# Altium project MOTOR_DRV_Projx.PrjPcb
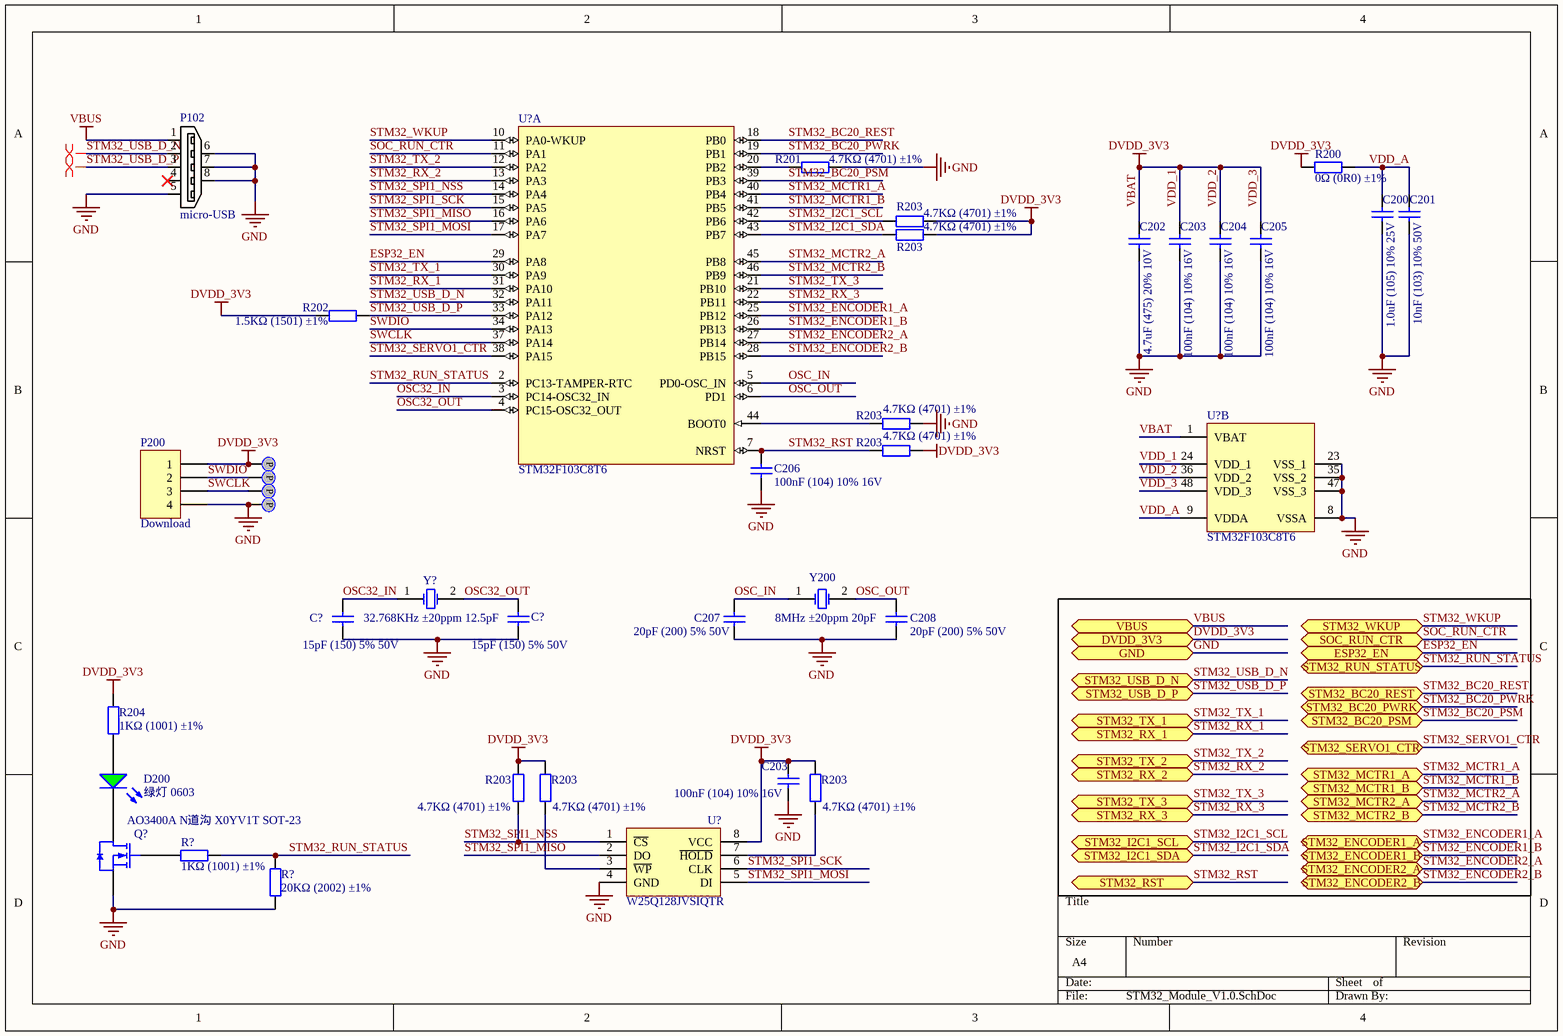
[diagram p0: STM32_Module_V1.0.SchDoc]
6 sheets, 151 parts. Net scope: flat (ports and power ports of the same name join across sheets).
Sheets:
  STM32_Module_V1.0.SchDoc
  ESP32_Module_V1.0.SchDoc
  BC20_Module_V1.0.SchDoc
  Motor_Driver_V1.0.SchDoc
  I2C_SENSOR_V1.0.SchDoc
  PWR_SWITCH_CON_V1.0.SchDoc

## Sheet STM32_Module_V1.0.SchDoc
size A4

### Parts
(Parts that share a designator on the sheet are numbered #1, #2 ... from top to bottom, then left to right.)
C200#1  1.0uF (105) 10% 25V  [0402_C]
C201#1  10nF (103) 10% 50V  [0402_C]
C202#1  4.7uF (475) 20% 10V  [0402_C]
C203#1  100nF (104) 10% 16V  [0402_C]
C203#2  100nF (104) 10% 16V  [0402_C]
C204  100nF (104) 10% 16V  [0402_C]
C205  100nF (104) 10% 16V  [0402_C]
C206  100nF (104) 10% 16V  [0402_C]
C207  20pF (200) 5% 50V  [0402_C]
C208  20pF (200) 5% 50V  [0402_C]
C?#1  15pF (150) 5% 50V  [0402_C]
C?#2  15pF (150) 5% 50V  [0402_C]
D200  绿灯 0603  [0603_LED_S1]
P102#1  micro-USB  [USB_MICRO]
P200  Download  [HDR1X4]
Probe100  Test Point  [Probe]  (value not drawn)
Probe101  Test Point  [Probe]  (value not drawn)
Probe103  Test Point  [Probe]  (value not drawn)
Probe104  Test Point  [Probe]  (value not drawn)
Q?#1  AO3400A N道沟 X0YV1T SOT-23  [SOT-23-3L]
R200  0Ω (0R0) ±1%  [0402_R]
R201  4.7KΩ (4701) ±1%  [0402_R]
R202  1.5KΩ (1501) ±1%  [0402_R]
R203#1  4.7KΩ (4701) ±1%  [0402_R]
R203#2  4.7KΩ (4701) ±1%  [0402_R]
R203#3  4.7KΩ (4701) ±1%  [0402_R]
R203#4  4.7KΩ (4701) ±1%  [0402_R]
R203#5  4.7KΩ (4701) ±1%  [0402_R]
R203#6  4.7KΩ (4701) ±1%  [0402_R]
R203#7  4.7KΩ (4701) ±1%  [0402_R]
R204  1KΩ (1001) ±1%  [0603_R]
R?#1  1KΩ (1001) ±1%  [0402_R]
R?#2  20KΩ (2002) ±1%  [0402_R]
U?#1  STM32F103C8T6  [LQFP-48_7x7x05P]  (part A of 2)
U?#2  STM32F103C8T6  [LQFP-48_7x7x05P]  (part B of 2)
U?#3  W25Q128JVSIQTR  [SOIC-8_208mil]
Y200  8MHz ±20ppm 20pF  [SMD-5032_2P]
Y?#1  32.768KHz ±20ppm 12.5pF  [SMD-3215_2P FC - 135]

### Ports
DVDD_3V3, ESP32_EN, GND, SOC_RUN_CTR, STM32_BC20_PSM, STM32_BC20_PWRK, STM32_BC20_REST, STM32_ENCODER1_A, STM32_ENCODER1_B, STM32_ENCODER2_A, STM32_ENCODER2_B, STM32_I2C1_SCL, STM32_I2C1_SDA, STM32_MCTR1_A, STM32_MCTR1_B, STM32_MCTR2_A, STM32_MCTR2_B, STM32_RST, STM32_RUN_STATUS, STM32_RX_1, STM32_RX_2, STM32_RX_3, STM32_SERVO1_CTR, STM32_TX_1, STM32_TX_2, STM32_TX_3, STM32_USB_D_N, STM32_USB_D_P, STM32_WKUP, VBUS

### Nets
DVDD_3V3: C202#1.2 C203#1.2 C203#2.2 C204.2 C205.2 P200.1 Probe100.0 R200.1 R202.2 R203#1.2 R203#2.2 R203#4.2 R203#5.2 R203#6.2 R203#7.2 R204.2 U?#2.1(VBAT) U?#2.24(VDD_1) U?#2.36(VDD_2) U?#2.48(VDD_3) U?#3.8(VCC) ; port DVDD_3V3  [also labelled VBAT, VDD_1, VDD_2, VDD_3]
GND: C200#1.1 C201#1.1 C202#1.1 C203#1.1 C203#2.1 C204.1 C205.1 C206.2 C207.1 C208.1 C?#1.1 C?#2.1 P102#1.5(GND) P102#1.6(SHELL) P102#1.7(SHELL) P102#1.8(SHELL) P200.4 Probe104.0 Q?#1.2(S) R201.2 R203#3.2 R?#2.1 U?#2.8(VSSA) U?#2.23(VSS_1) U?#2.35(VSS_2) U?#2.47(VSS_3) U?#3.4(GND) ; port GND
VBUS: P102#1.1(VBUS) ; port VBUS
ESP32_EN: U?#1.29(PA8) ; port ESP32_EN  [project net EN]
OSC32_IN: C?#1.2 U?#1.3(PC14-OSC32_IN) Y?#1.1(OSC1)
OSC32_OUT: C?#2.2 U?#1.4(PC15-OSC32_OUT) Y?#1.2(OSC2)
OSC_IN: C207.2 U?#1.5(PD0-OSC_IN) Y200.1(OSC1)
OSC_OUT: C208.2 U?#1.6(PD1) Y200.2(OSC2)
SOC_RUN_CTR: U?#1.11(PA1) ; port SOC_RUN_CTR
STM32_BC20_PSM: U?#1.39(PB3) ; port STM32_BC20_PSM
STM32_BC20_PWRK: U?#1.19(PB1) ; port STM32_BC20_PWRK
STM32_BC20_REST: U?#1.18(PB0) ; port STM32_BC20_REST
STM32_ENCODER1_A: U?#1.25(PB12) ; port STM32_ENCODER1_A
STM32_ENCODER1_B: U?#1.26(PB13) ; port STM32_ENCODER1_B
STM32_ENCODER2_A: U?#1.27(PB14) ; port STM32_ENCODER2_A
STM32_ENCODER2_B: U?#1.28(PB15) ; port STM32_ENCODER2_B
STM32_I2C1_SCL: R203#1.1 U?#1.42(PB6) ; port STM32_I2C1_SCL
STM32_I2C1_SDA: R203#2.1 U?#1.43(PB7) ; port STM32_I2C1_SDA
STM32_MCTR1_A: U?#1.40(PB4) ; port STM32_MCTR1_A
STM32_MCTR1_B: U?#1.41(PB5) ; port STM32_MCTR1_B
STM32_MCTR2_A: U?#1.45(PB8) ; port STM32_MCTR2_A
STM32_MCTR2_B: U?#1.46(PB9) ; port STM32_MCTR2_B
STM32_RST: C206.1 R203#4.1 U?#1.7(NRST) ; port STM32_RST  [project net IO21]
STM32_RUN_STATUS: R?#1.2 R?#2.2 U?#1.2(PC13-TAMPER-RTC) ; port STM32_RUN_STATUS  [project net CH_SELECT]
STM32_RX_1: U?#1.31(PA10) ; port STM32_RX_1
STM32_RX_2: U?#1.13(PA3) ; port STM32_RX_2
STM32_RX_3: U?#1.22(PB11) ; port STM32_RX_3  [project net ESP32_TX1]
STM32_SERVO1_CTR: U?#1.38(PA15) ; port STM32_SERVO1_CTR
STM32_SPI1_MISO: U?#1.16(PA6) U?#3.2(DO)
STM32_SPI1_MOSI: U?#1.17(PA7) U?#3.5(DI)
STM32_SPI1_NSS: R203#5.1 U?#1.14(PA4) U?#3.1(~{CS})
STM32_SPI1_SCK: U?#1.15(PA5) U?#3.6(CLK)
STM32_TX_1: U?#1.30(PA9) ; port STM32_TX_1
STM32_TX_2: U?#1.12(PA2) ; port STM32_TX_2
STM32_TX_3: U?#1.21(PB10) ; port STM32_TX_3  [project net ESP32_RX1]
STM32_USB_D_N: P102#1.2(D-) U?#1.32(PA11) ; port STM32_USB_D_N
STM32_USB_D_P: P102#1.3(D+) R202.1 U?#1.33(PA12) ; port STM32_USB_D_P
STM32_WKUP: U?#1.10(PA0-WKUP) ; port STM32_WKUP
SWCLK: P200.3 Probe103.0 U?#1.37(PA14)
SWDIO: P200.2 Probe101.0 U?#1.34(PA13)
VDD_A: C200#1.2 C201#1.2 R200.2 U?#2.9(VDDA)
NetD200_A: D200.A R204.1
NetD200_K: D200.K Q?#1.3(D)
NetQ?#1_1: Q?#1.1(G) R?#1.1
NetR201_1: R201.1 U?#1.20(PB2)
NetR203#3_1: R203#3.1 U?#1.44(BOOT0)
NetR203#6_1: R203#6.1 U?#3.3(~{WP})
NetR203#7_1: R203#7.1 U?#3.7(~{HOLD})

Not connected (* = marked no-connect by the designer): P102#1 4(ID)*

### Layout directives
differential pair: STM32_USB_D_N, STM32_USB_D_P

### Notes on the sheet
- (in symbol Test_Point) P

### Library data of the parts
C200#1 = 0402 1.0uF (105) 10% 25V: 贴片电容; ComponentLink1Description: 供应商链接; ComponentLink1URL: http://www.szlcsc.com/product/details_53938.html; Package: 0402; Supplier: LC; SuppliersPartNumber: C52923
C201#1 = 0402 10nF (103) 10% 50V: 贴片电容; ComponentLink1Description: 供应商链接; ComponentLink1URL: http://www.szlcsc.com/product/details_15869.html; Package: 0402; Supplier: LC; SuppliersPartNumber: C15195
C202#1 = 0402 4.7uF (475) 20% 10V: 贴片电容; ComponentLink1Description: 供应商链接; ComponentLink1URL: http://www.szlcsc.com/product/details_24469.html; Package: 0402; Supplier: LC; SuppliersPartNumber: C23733
C203#1 C203#2 C204-C206 = 0402 100nF (104) 10% 16V: 贴片电容; ComponentLink1Description: 供应商链接; ComponentLink1URL: http://www.szlcsc.com/product/details_1877.html; Package: 0402; Supplier: LC; SuppliersPartNumber: C1525
C207 C208 = 0402 20pF (200) 5% 50V: 贴片电容; ComponentLink1Description: 供应商链接; ComponentLink1URL: http://www.szlcsc.com/product/details_1906.html; Package: 0402; Supplier: LC; SuppliersPartNumber: C1554
C?#1 C?#2 = 0402 15pF (150) 5% 50V: 贴片电容; ComponentLink1Description: 供应商链接; ComponentLink1URL: http://www.szlcsc.com/product/details_1900.html; Package: 0402; Supplier: LC; SuppliersPartNumber: C1548
D200 = 0603 绿灯: 发光二极管; ComponentLink1Description: 供应商链接; ComponentLink1URL: http://www.szlcsc.com/product/details_73152.html; Package: 0603; Supplier: LC; SuppliersPartNumber: C72043
P200 = Header 4: Header, 4-Pin; LatestRevisionDate: 17-Jul-2002; LatestRevisionNote: Re-released for DXP Platform.; Publisher: Altium Limited
Probe100 Probe101 Probe103 Probe104 = Test_Point
Q?#1 = AO3400A N道沟 X0YV1T SOT-23: MOS(场效应管); ComponentLink1Description: 供应商链接; ComponentLink1URL: http://www.szlcsc.com/product/details_21629.html; Package: SOT-23; Supplier: LC; SuppliersPartNumber: C20917
R200 = 0402 0Ω (0R0) 1%: 贴片电阻; ComponentLink1Description: 供应商链接; ComponentLink1URL: http://www.szlcsc.com/product/details_17853.html; Package: 0402; Supplier: LC; SuppliersPartNumber: C17168
R201 R203#1-R203#7 = 0402 4.7KΩ (4701) 1%: 贴片电阻; ComponentLink1Description: 供应商链接; ComponentLink1URL: http://www.szlcsc.com/product/details_26643.html; Package: 0402; Supplier: LC; SuppliersPartNumber: C25900
R202 = 0402 1.5KΩ (1501) 1%: 贴片电阻; ComponentLink1Description: 供应商链接; ComponentLink1URL: http://www.szlcsc.com/product/details_26610.html; Package: 0402; Supplier: LC; SuppliersPartNumber: C25867
R204 = 0603 1KΩ (1001) 1%: 贴片电阻; ComponentLink1Description: 供应商链接; ComponentLink1URL: http://www.szlcsc.com/product/details_21904.html; Package: 0603; Supplier: LC; SuppliersPartNumber: C21190
R?#1 = 0402 1KΩ (1001) 1%: 贴片电阻; ComponentLink1Description: 供应商链接; ComponentLink1URL: http://www.szlcsc.com/product/details_12256.html; Package: 0402; Supplier: LC; SuppliersPartNumber: C11702
R?#2 = 0402 20KΩ (2002) 1%: 贴片电阻; ComponentLink1Description: 供应商链接; ComponentLink1URL: http://www.szlcsc.com/product/details_26508.html; Package: 0402; Supplier: LC; SuppliersPartNumber: C25765
U?#1 U?#2 = STM32F103C8T6: ARM; ComponentLink1Description: 供应商链接; ComponentLink1URL: http://www.szlcsc.com/product/details_9243.html; Package: LQFP-48_7x7x05P; Supplier: LC; SuppliersPartNumber: C8734
U?#3 = W25Q128JVSIQTR_[C97521]: Flash ROM; ComponentLink1Description: 供应商链接; ComponentLink1URL: https://item.szlcsc.com/98729.html; Package: SOIC-8; Supplier: LC; SuppliersPartNumber: C97521
Y200 = SMD-5032_2P 8MHz 20ppm 20pF: 贴片晶振; ComponentLink1Description: 供应商链接; ComponentLink1URL: http://www.szlcsc.com/product/details_117214.html; Package: SMD-5032_2P; Supplier: LC; SuppliersPartNumber: C115962
Y?#1 = SMD-3215_2P 32.768KHz 20ppm 12.5pF: 贴片晶振; ComponentLink1Description: 供应商链接; ComponentLink1URL: http://www.szlcsc.com/product/details_33310.html; Package: SMD-3215_2P; Supplier: LC; SuppliersPartNumber: C32346

## Sheet ESP32_Module_V1.0.SchDoc
size A4
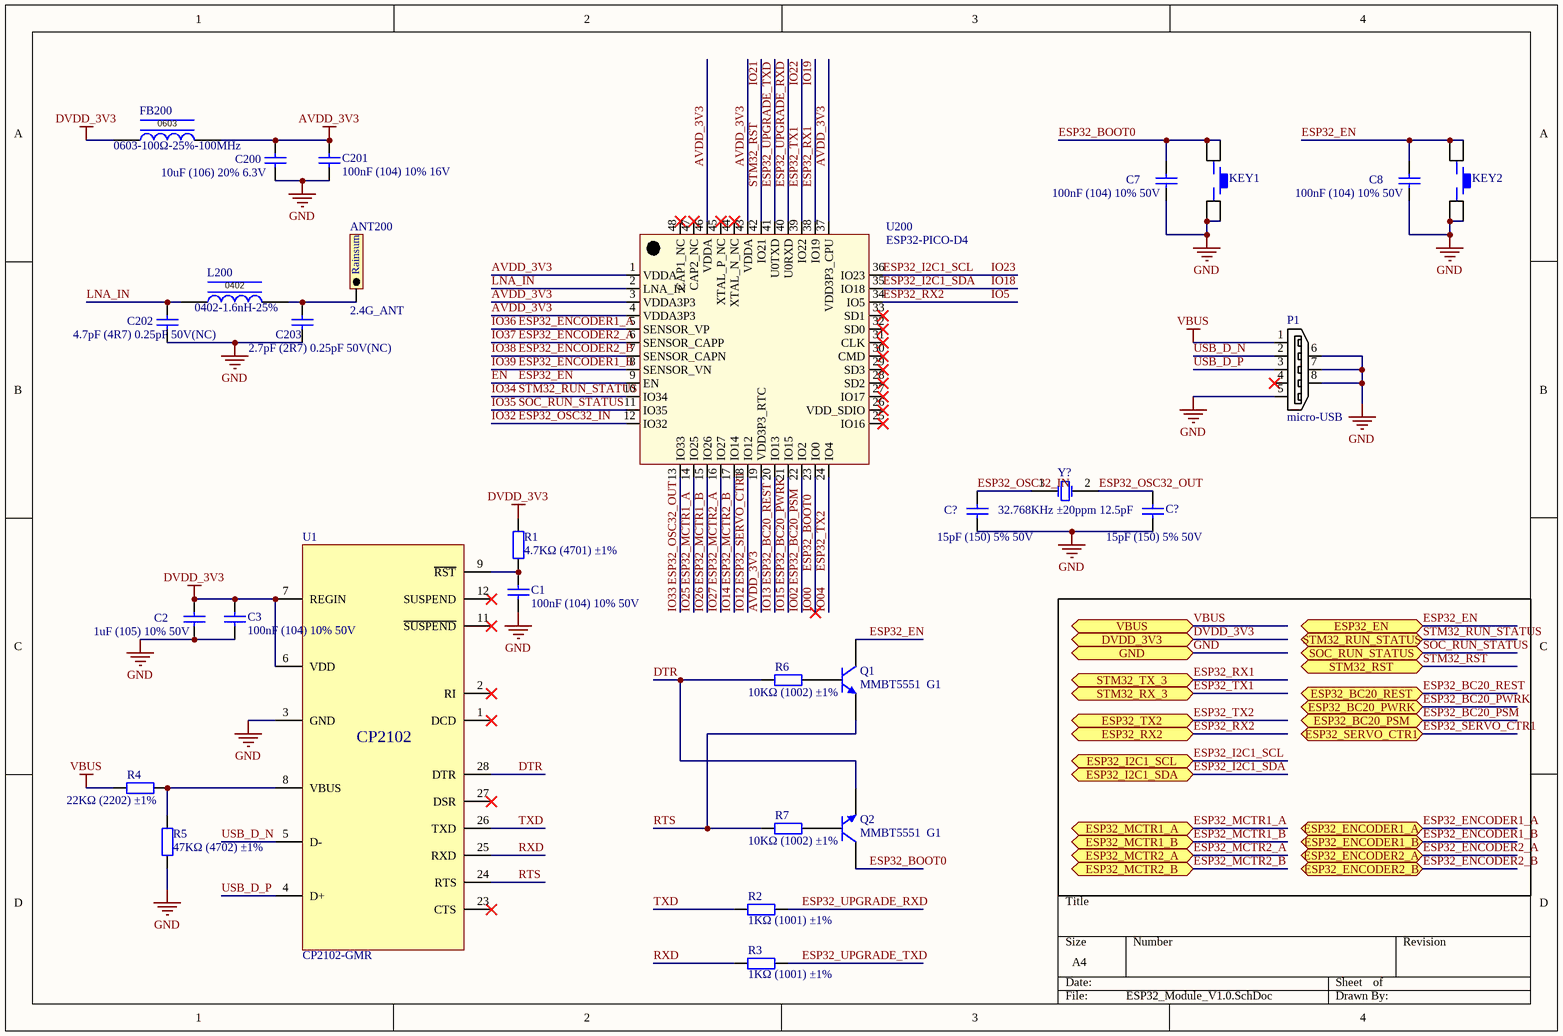
[diagram p1: ESP32_Module_V1.0.SchDoc]

### Parts
(Parts that share a designator on the sheet are numbered #1, #2 ... from top to bottom, then left to right.)
ANT200  2.4G_ANT  [AN9520-245]
C1  100nF (104) 10% 50V  [0603_C]
C2  1uF (105) 10% 50V  [0603_C]
C3  100nF (104) 10% 50V  [0603_C]
C7  100nF (104) 10% 50V  [0603_C]
C8  100nF (104) 10% 50V  [0603_C]
C200#2  10uF (106) 20% 6.3V  [0402_C]
C201#2  100nF (104) 10% 16V  [0402_C]
C202#2  4.7pF (4R7) 0.25pF 50V(NC)  [0402_C]
C203#3  2.7pF (2R7) 0.25pF 50V(NC)  [0402_C]
C?#3  15pF (150) 5% 50V  [0402_C]
C?#4  15pF (150) 5% 50V  [0402_C]
FB200  0603-100Ω-25%-100MHz  [0603_L]
KEY1  KEY  [KEY_C127478]  (value not drawn)
KEY2  KEY  [KEY_C127478]  (value not drawn)
L200  0402-1.6nH-25%  [0402_L]
P1  micro-USB  [USB_MICRO]
Q1  MMBT5551  G1  [SOT-23(SOT-23-3)]
Q2  MMBT5551  G1  [SOT-23(SOT-23-3)]
R1  4.7KΩ (4701) ±1%  [0603_R]
R2  1KΩ (1001) ±1%  [0603_R]
R3  1KΩ (1001) ±1%  [0603_R]
R4  22KΩ (2202) ±1%  [0603_R]
R5  47KΩ (4702) ±1%  [0603_R]
R6  10KΩ (1002) ±1%  [0603_R]
R7  10KΩ (1002) ±1%  [0603_R]
U1  CP2102-GMR  [QFN-28_5x5x05P]
U200  ESP32-PICO-D4  [QFN-48_7x7x05P]
Y?#2  32.768KHz ±20ppm 12.5pF  [SMD-3215_2P FC - 135]

### Ports
DVDD_3V3, ESP32_BC20_PSM, ESP32_BC20_PWRK, ESP32_BC20_REST, ESP32_EN, ESP32_ENCODER1_A, ESP32_ENCODER1_B, ESP32_ENCODER2_A, ESP32_ENCODER2_B, ESP32_I2C1_SCL, ESP32_I2C1_SDA, ESP32_MCTR1_A, ESP32_MCTR1_B, ESP32_MCTR2_A, ESP32_MCTR2_B, ESP32_RX2, ESP32_SERVO_CTR1, ESP32_TX2, GND, SOC_RUN_STATUS, STM32_RST, STM32_RUN_STATUS, STM32_RX_3, STM32_TX_3, VBUS

### Nets
AVDD_3V3: C200#2.2 C201#2.2 FB200.2 U200.1(VDDA) U200.3(VDDA3P3) U200.4(VDDA3P3) U200.19(VDD3P3_RTC) U200.37(VDD3P3_CPU) U200.43(VDDA) U200.46(VDDA)
DVDD_3V3: C2.2 C3.2 FB200.1 R1.2 U1.6(VDD) U1.7(REGIN) ; port DVDD_3V3
GND: C1.1 C2.1 C3.1 C7.1 C8.1 C200#2.1 C201#2.1 C202#2.1 C203#3.1 C?#3.1 C?#4.1 KEY1.3 KEY1.4 KEY2.3 KEY2.4 P1.5(GND) P1.6(SHELL) P1.7(SHELL) P1.8(SHELL) R5.1 U1.3(GND) ; port GND
VBUS: P1.1(VBUS) R4.1 ; port VBUS
DTR: Q2.2(E) R6.1 U1.28(DTR)
EN: C8.2 KEY2.1 KEY2.2 Q1.3(C) U200.9(EN) ; port ESP32_EN  [also labelled ESP32_EN]
ESP32_BC20_PSM: U200.22(IO2) ; port ESP32_BC20_PSM  [also labelled IO02]
ESP32_BC20_PWRK: U200.21(IO15) ; port ESP32_BC20_PWRK  [also labelled IO15]
ESP32_BC20_REST: U200.20(IO13) ; port ESP32_BC20_REST  [also labelled IO13]
ESP32_BOOT0: C7.2 KEY1.1 KEY1.2 Q2.3(C) U200.23(IO0)  [also labelled IO00]
ESP32_ENCODER1_A: U200.5(SENSOR_VP) ; port ESP32_ENCODER1_A  [also labelled IO36]
ESP32_ENCODER1_B: U200.8(SENSOR_VN) ; port ESP32_ENCODER1_B  [also labelled IO39]
ESP32_ENCODER2_A: U200.6(SENSOR_CAPP) ; port ESP32_ENCODER2_A  [also labelled IO37]
ESP32_ENCODER2_B: U200.7(SENSOR_CAPN) ; port ESP32_ENCODER2_B  [also labelled IO38]
ESP32_I2C1_SCL: U200.36(IO23) ; port ESP32_I2C1_SCL  [also labelled IO23]
ESP32_I2C1_SDA: U200.35(IO18) ; port ESP32_I2C1_SDA  [also labelled IO18]
ESP32_MCTR1_A: U200.14(IO25) ; port ESP32_MCTR1_A  [also labelled IO25]
ESP32_MCTR1_B: U200.15(IO26) ; port ESP32_MCTR1_B  [also labelled IO26]
ESP32_MCTR2_A: U200.16(IO27) ; port ESP32_MCTR2_A  [also labelled IO27]
ESP32_MCTR2_B: U200.17(IO14) ; port ESP32_MCTR2_B  [also labelled IO14]
ESP32_OSC32_IN: C?#3.2 U200.12(IO32) Y?#2.1(OSC1)  [also labelled IO32]
ESP32_OSC32_OUT: C?#4.2 U200.13(IO33) Y?#2.2(OSC2)  [also labelled IO33]
ESP32_RX1: U200.38(IO19) ; port STM32_TX_3  [also labelled IO19]
ESP32_RX2: U200.34(IO5) ; port ESP32_RX2  [also labelled IO5]
ESP32_SERVO_CTR1: U200.18(IO12) ; port ESP32_SERVO_CTR1  [also labelled IO12]
ESP32_TX1: U200.39(IO22) ; port STM32_RX_3  [also labelled IO22]
ESP32_TX2: U200.24(IO4) ; port ESP32_TX2  [also labelled IO04]
ESP32_UPGRADE_RXD: R2.2 U200.40(U0RXD)
ESP32_UPGRADE_TXD: R3.2 U200.41(U0TXD)
IO21: U200.42(IO21) ; port STM32_RST  [also labelled STM32_RST]
IO34: U200.10(IO34) ; port STM32_RUN_STATUS  [also labelled STM32_RUN_STATUS]  [project net CH_SELECT]
IO35: U200.11(IO35) ; port SOC_RUN_STATUS  [also labelled SOC_RUN_STATUS]
LNA_IN: C202#2.2 L200.1 U200.2(LNA_IN)
RTS: Q1.2(E) R7.1 U1.24(RTS)
RXD: R3.1 U1.25(RXD)
TXD: R2.1 U1.26(TXD)
USB_D_N: P1.2(D-) U1.5(D-)
USB_D_P: P1.3(D+) U1.4(D+)
NetANT200_1: ANT200.1 C203#3.2 L200.2
NetC1_2: C1.2 R1.1 U1.9(~{RST})
NetQ1_1: Q1.1(B) R6.2
NetQ2_1: Q2.1(B) R7.2
NetR4_2: R4.2 R5.2 U1.8(VBUS)

Not connected (* = marked no-connect by the designer): P1 4(ID)*; U1 1(DCD)* 2(RI)* 11(~{SUSPEND})* 12(SUSPEND)* 23(CTS)* 27(DSR)*; U200 25(IO16)* 26(VDD_SDIO)* 27(IO17)* 28(SD2)* 29(SD3)* 30(CMD)* 31(CLK)* 32(SD0)* 33(SD1)* 44(XTAL_N_NC)* 45(XTAL_P_NC)* 47(CAP2_NC)* 48(CAP1_NC)*

### Notes on the sheet
- (in symbol 2.4G_ANT) Rainsum
- (in symbol 0402 100Ω 25% 100MHz) 0402
- (in symbol 0603 100Ω 25% 100MHz) 0603
- (in symbol CP2102-GMR_[C6568]) CP2102

### Library data of the parts
C1 C3 C7 C8 = 0603 100nF (104) 10% 50V: 贴片电容; ComponentLink1Description: 供应商链接; ComponentLink1URL: http://www.szlcsc.com/product/details_15331.html; Package: 0603; Supplier: LC; SuppliersPartNumber: C14663
C2 = 0603 1uF (105) 10% 50V: 贴片电容; ComponentLink1Description: 供应商链接; ComponentLink1URL: http://www.szlcsc.com/product/details_16531.html; Package: 0603; Supplier: LC; SuppliersPartNumber: C15849
C200#2 = 0402 10uF (106) 20% 6.3V: 贴片电容; ComponentLink1Description: 供应商链接; ComponentLink1URL: http://www.szlcsc.com/product/details_16204.html; Package: 0402; Supplier: LC; SuppliersPartNumber: C15525
C201#2 = 0402 100nF (104) 10% 16V: 贴片电容; ComponentLink1Description: 供应商链接; ComponentLink1URL: http://www.szlcsc.com/product/details_1877.html; Package: 0402; Supplier: LC; SuppliersPartNumber: C1525
C202#2 = 0402 4.7pF (4R7) 0.25pF 50V: 贴片电容; ComponentLink1Description: 供应商链接; ComponentLink1URL: http://www.szlcsc.com/product/details_1921.html; Package: 0402; Supplier: LC; SuppliersPartNumber: C1569
C203#3 = 0402 2.7pF (2R7) 0.25pF 50V: 贴片电容; ComponentLink1Description: 供应商链接; ComponentLink1URL: http://www.szlcsc.com/product/details_1913.html; Package: 0402; Supplier: LC; SuppliersPartNumber: C1561
C?#3 C?#4 = 0402 15pF (150) 5% 50V: 贴片电容; ComponentLink1Description: 供应商链接; ComponentLink1URL: http://www.szlcsc.com/product/details_1900.html; Package: 0402; Supplier: LC; SuppliersPartNumber: C1548
FB200 = 0603 100Ω 25% 100MHz: 贴片磁珠
L200 = 0402 100Ω 25% 100MHz: 贴片电感
Q1 Q2 = SOT-23 MMBT5551  G1: 三极管; ComponentLink1Description: 供应商链接; ComponentLink1URL: http://www.szlcsc.com/product/details_2502.html; Package: SOT-23; Supplier: LC; SuppliersPartNumber: C2145
R1 = 0603 4.7KΩ (4701) 1%: 贴片电阻; ComponentLink1Description: 供应商链接; ComponentLink1URL: http://www.szlcsc.com/product/details_23889.html; Package: 0603; Supplier: LC; SuppliersPartNumber: C23162
R2 R3 = 0603 1KΩ (1001) 1%: 贴片电阻; ComponentLink1Description: 供应商链接; ComponentLink1URL: http://www.szlcsc.com/product/details_21904.html; Package: 0603; Supplier: LC; SuppliersPartNumber: C21190
R4 = 0603 22KΩ (2202) 1%: 贴片电阻; ComponentLink1Description: 供应商链接; ComponentLink1URL: http://www.szlcsc.com/product/details_32812.html; Package: 0603; Supplier: LC; SuppliersPartNumber: C31850
R5 = 0603 47KΩ (4702) 1%: 贴片电阻; ComponentLink1Description: 供应商链接; ComponentLink1URL: http://www.szlcsc.com/product/details_26562.html; Package: 0603; Supplier: LC; SuppliersPartNumber: C25819
R6 R7 = 0603 10KΩ (1002) 1%: 贴片电阻; ComponentLink1Description: 供应商链接; ComponentLink1URL: http://www.szlcsc.com/product/details_26547.html; Package: 0603; Supplier: LC; SuppliersPartNumber: C25804
U1 = CP2102-GMR_[C6568]: USB; ComponentLink1Description: 供应商链接; ComponentLink1URL: http://www.szlcsc.com/product/details_7033.html; Package: QFN-28_5x5x05P; Supplier: LC; SuppliersPartNumber: C6568
U200 = ESP32-PICO-D4: WIFI_BLE IC
Y?#2 = SMD-3215_2P 32.768KHz 20ppm 12.5pF: 贴片晶振; ComponentLink1Description: 供应商链接; ComponentLink1URL: http://www.szlcsc.com/product/details_33310.html; Package: SMD-3215_2P; Supplier: LC; SuppliersPartNumber: C32346

## Sheet BC20_Module_V1.0.SchDoc
size A3
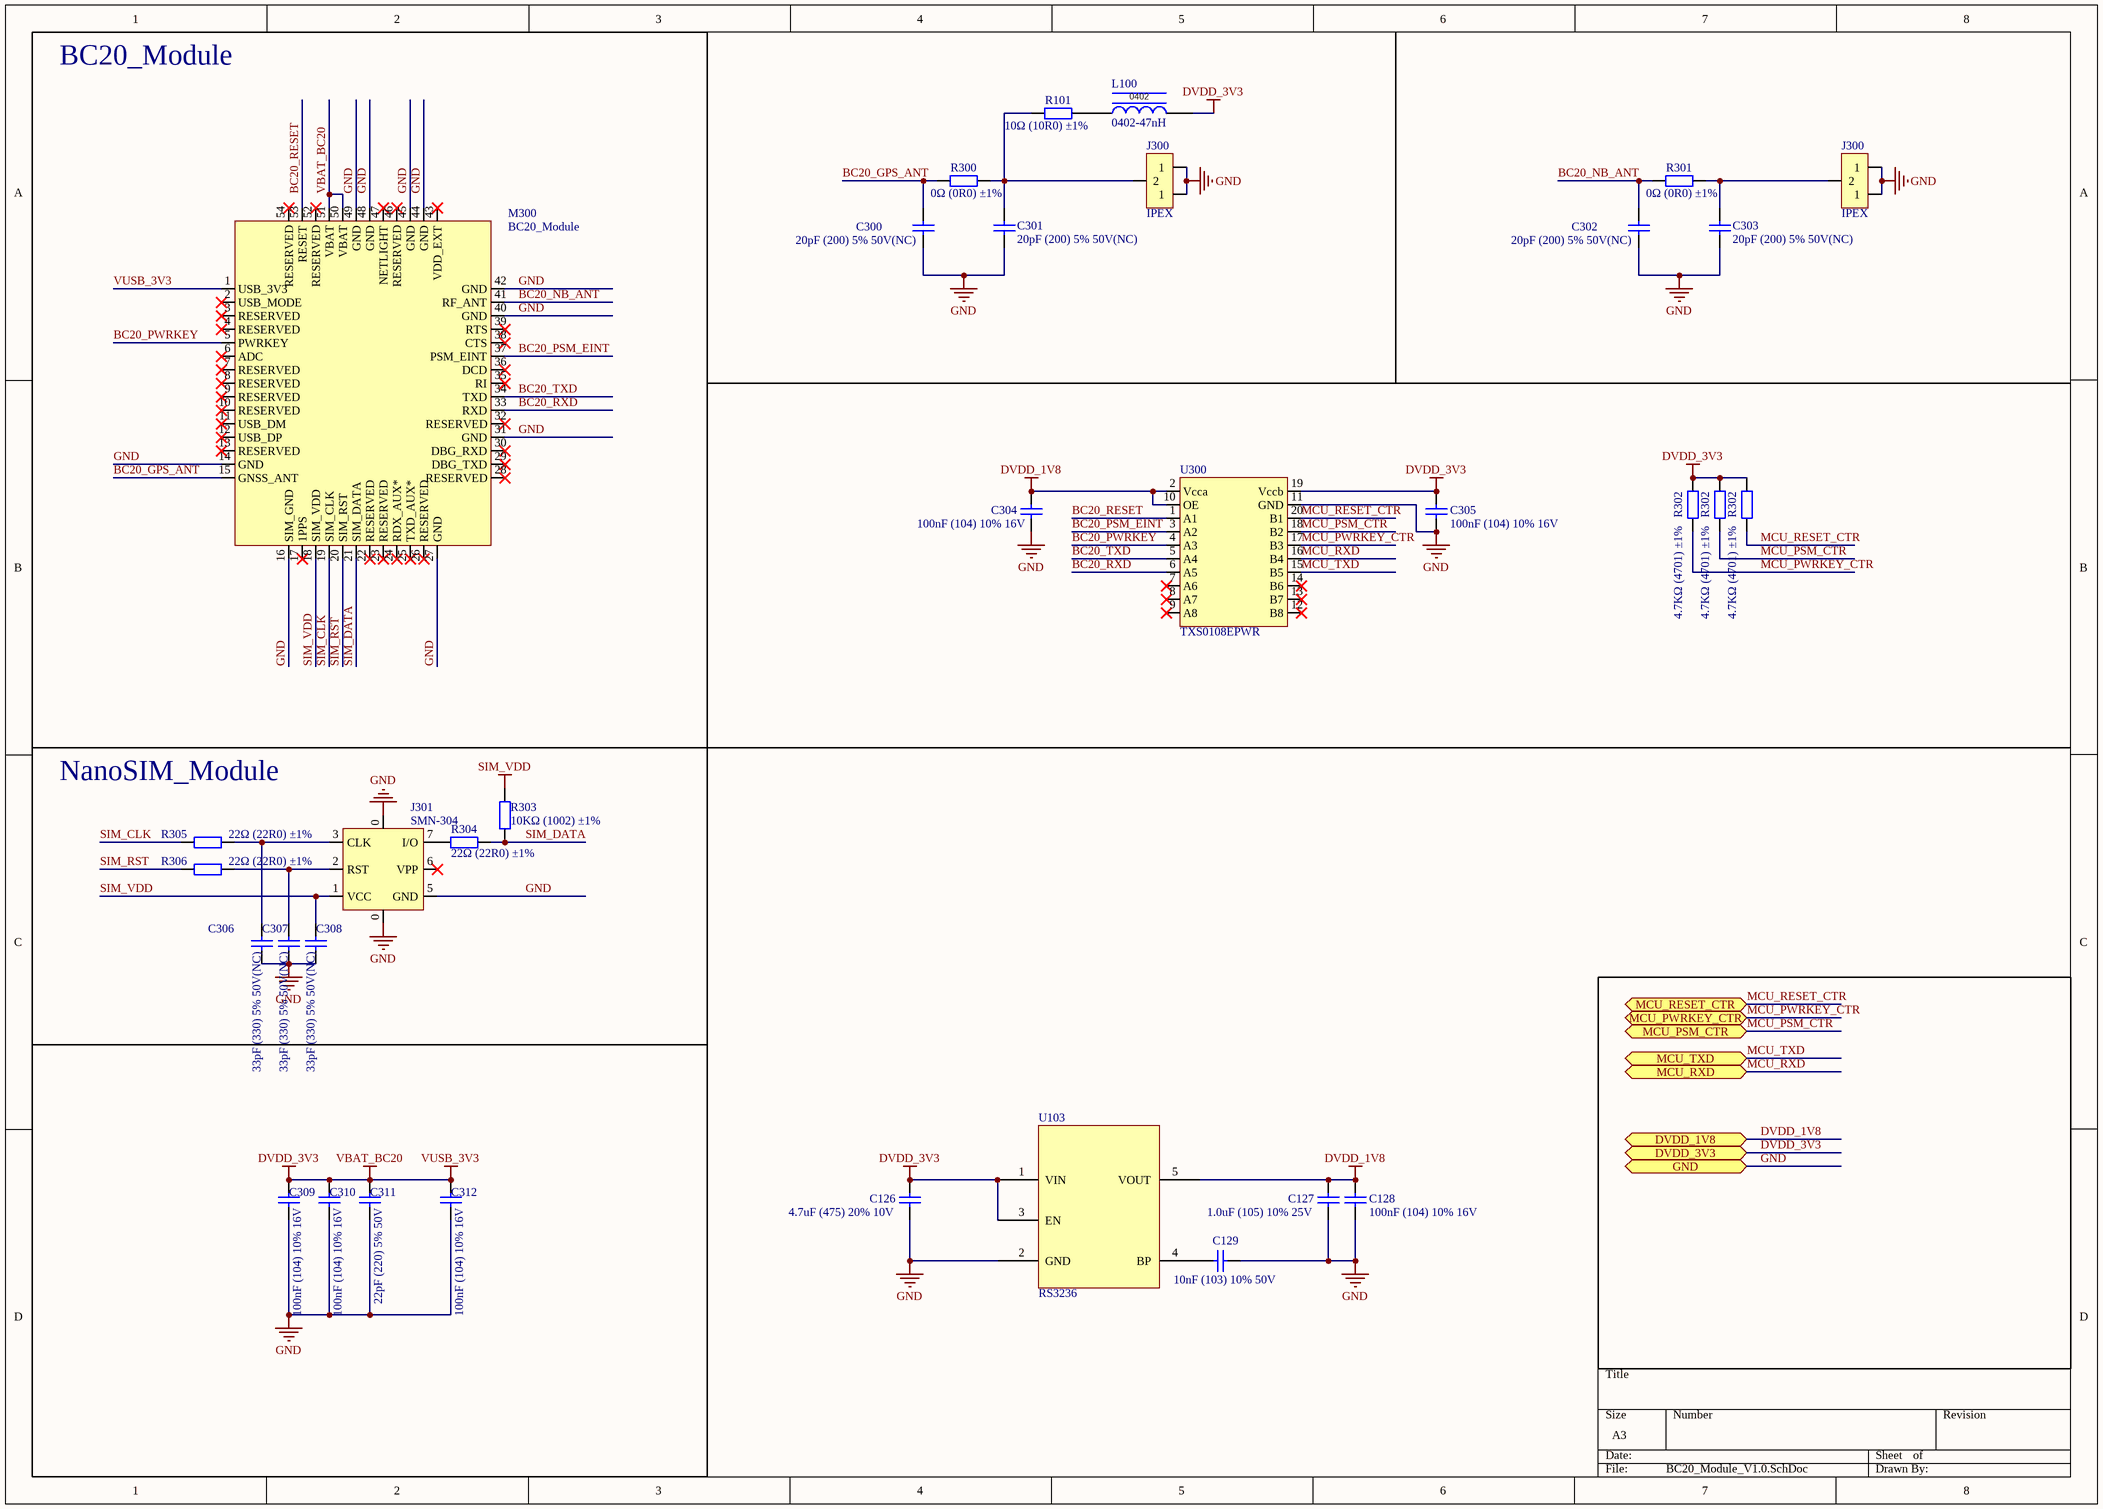
[diagram p2: BC20_Module_V1.0.SchDoc]

### Parts
(Parts that share a designator on the sheet are numbered #1, #2 ... from top to bottom, then left to right.)
C126  4.7uF (475) 20% 10V  [0402_C]
C127  1.0uF (105) 10% 25V  [0402_C]
C128  100nF (104) 10% 16V  [0402_C]
C129  10nF (103) 10% 50V  [0402_C]
C300  20pF (200) 5% 50V(NC)  [0402_C]
C301  20pF (200) 5% 50V(NC)  [0402_C]
C302  20pF (200) 5% 50V(NC)  [0402_C]
C303  20pF (200) 5% 50V(NC)  [0402_C]
C304  100nF (104) 10% 16V  [0402_C]
C305  100nF (104) 10% 16V  [0402_C]
C306  33pF (330) 5% 50V(NC)  [0402_C]
C307  33pF (330) 5% 50V(NC)  [0402_C]
C308  33pF (330) 5% 50V(NC)  [0402_C]
C309  100nF (104) 10% 16V  [0402_C]
C310  100nF (104) 10% 16V  [0402_C]
C311  22pF (220) 5% 50V  [0402_C]
C312  100nF (104) 10% 16V  [0402_C]
J300#1  IPEX  [IPEX]
J300#2  IPEX  [IPEX]
J301  SMN-304  [SMN-304]
L100  0402-47nH  [0402_L]
M300  BC20_Module  [BC20_Module]
R101#1  10Ω (10R0) ±1%  [0402_R]
R300  0Ω (0R0) ±1%  [0402_R]
R301  0Ω (0R0) ±1%  [0402_R]
R302#1  4.7KΩ (4701) ±1%  [0402_R]
R302#2  4.7KΩ (4701) ±1%  [0402_R]
R302#3  4.7KΩ (4701) ±1%  [0402_R]
R303  10KΩ (1002) ±1%  [0402_R]
R304  22Ω (22R0) ±1%  [0402_R]
R305  22Ω (22R0) ±1%  [0402_R]
R306  22Ω (22R0) ±1%  [0402_R]
U103  RS3236  [SOT-23-5]
U300  TXS0108EPWR  [TSSOP-20]

### Blocks framed on the sheet
BC20_Module: M300

### Ports
DVDD_1V8, DVDD_3V3, GND, MCU_PSM_CTR, MCU_PWRKEY_CTR, MCU_RESET_CTR, MCU_RXD, MCU_TXD

### Nets
DVDD_1V8: C127.2 C128.2 C304.2 U103.5(VOUT) U300.2(Vcca) U300.10(OE) ; port DVDD_1V8
DVDD_3V3: C126.2 C305.2 C309.2 C310.2 C311.2 C312.2 L100.2 M300.1(USB_3V3) M300.50(VBAT) M300.51(VBAT) R302#1.2 R302#2.2 R302#3.2 U103.1(VIN) U103.3(EN) U300.19(Vccb) ; port DVDD_3V3  [also labelled VBAT_BC20, VUSB_3V3]
GND: C126.1 C127.1 C128.1 C129.1 C300.1 C301.1 C302.1 C303.1 C304.1 C305.1 C306.1 C307.1 C308.1 C309.1 C310.1 C311.1 C312.1 J300#1.1 J300#2.1 J301.0(GND) J301.5(GND) M300.14(GND) M300.16(SIM_GND) M300.27(GND) M300.31(GND) M300.40(GND) M300.42(GND) M300.44(GND) M300.45(GND) M300.48(GND) M300.49(GND) U103.2(GND) U300.11(GND) ; port GND
SIM_VDD: C308.2 J301.1(VCC) M300.18(SIM_VDD) R303.2
BC20_GPS_ANT: C300.2 M300.15(GNSS_ANT) R300.1
BC20_NB_ANT: C302.2 M300.41(RF_ANT) R301.1
BC20_PSM_EINT: M300.37(PSM_EINT) U300.3(A2)
BC20_PWRKEY: M300.5(PWRKEY) U300.4(A3)
BC20_RESET: M300.53(RESET) U300.1(A1)
BC20_RXD: M300.33(RXD) U300.6(A5)
BC20_TXD: M300.34(TXD) U300.5(A4)
MCU_PSM_CTR: R302#2.1 U300.18(B2) ; port MCU_PSM_CTR
MCU_PWRKEY_CTR: R302#1.1 U300.17(B3) ; port MCU_PWRKEY_CTR
MCU_RESET_CTR: R302#3.1 U300.20(B1) ; port MCU_RESET_CTR
MCU_RXD: U300.16(B4) ; port MCU_RXD
MCU_TXD: U300.15(B5) ; port MCU_TXD
SIM_CLK: M300.19(SIM_CLK) R305.1
SIM_DATA: M300.21(SIM_DATA) R303.1 R304.2
SIM_RST: M300.20(SIM_RST) R306.1
NetC129_2: C129.2 U103.4(BP)
NetC301_2: C301.2 J300#1.2 R101#1.1 R300.2
NetC303_2: C303.2 J300#2.2 R301.2
NetC306_2: C306.2 J301.3(CLK) R305.2
NetC307_2: C307.2 J301.2(RST) R306.2
NetJ301_7: J301.7(I/O) R304.1
NetL100_1: L100.1 R101#1.2

Not connected (* = marked no-connect by the designer): J301 6(VPP)*; M300 2(USB_MODE)* 3(RESERVED)* 4(RESERVED)* 6(ADC)* 7(RESERVED)* 8(RESERVED)* 9(RESERVED)* 10(RESERVED)* 11(USB_DM)* 12(USB_DP)* 13(RESERVED)* 17(1PPS)* 22(RESERVED)* 23(RESERVED)* 24(RDX_AUX*)* 25(TXD_AUX*)* 26(RESERVED)* 28(RESERVED)* 29(DBG_TXD)* 30(DBG_RXD)* 32(RESERVED)* 35(RI)* 36(DCD)* 38(CTS)* 39(RTS)* 43(VDD_EXT)* 46(RESERVED)* 47(NETLIGHT)* 52(RESERVED)* 54(RESERVED)*; U300 7(A6)* 8(A7)* 9(A8)* 12(B8)* 13(B7)* 14(B6)*

### Notes on the sheet
- NanoSIM_Module
- (in symbol 0402 100Ω 25% 100MHz) 0402

### Library data of the parts
C126 = 0402 4.7uF (475) 20% 10V: 贴片电容; ComponentLink1Description: 供应商链接; ComponentLink1URL: http://www.szlcsc.com/product/details_24469.html; Package: 0402; Supplier: LC; SuppliersPartNumber: C23733
C127 = 0402 1.0uF (105) 10% 25V: 贴片电容; ComponentLink1Description: 供应商链接; ComponentLink1URL: http://www.szlcsc.com/product/details_53938.html; Package: 0402; Supplier: LC; SuppliersPartNumber: C52923
C128 C304 C305 C309 C310 C312 = 0402 100nF (104) 10% 16V: 贴片电容; ComponentLink1Description: 供应商链接; ComponentLink1URL: http://www.szlcsc.com/product/details_1877.html; Package: 0402; Supplier: LC; SuppliersPartNumber: C1525
C129 = 0402 10nF (103) 10% 50V: 贴片电容; ComponentLink1Description: 供应商链接; ComponentLink1URL: http://www.szlcsc.com/product/details_15869.html; Package: 0402; Supplier: LC; SuppliersPartNumber: C15195
C300-C303 = 0402 20pF (200) 5% 50V: 贴片电容; ComponentLink1Description: 供应商链接; ComponentLink1URL: http://www.szlcsc.com/product/details_1906.html; Package: 0402; Supplier: LC; SuppliersPartNumber: C1554
C306-C308 = 0402 33pF (330) 5% 50V: 贴片电容; ComponentLink1Description: 供应商链接; ComponentLink1URL: http://www.szlcsc.com/product/details_1914.html; Package: 0402; Supplier: LC; SuppliersPartNumber: C1562
C311 = 0402 22pF (220) 5% 50V: 贴片电容; ComponentLink1Description: 供应商链接; ComponentLink1URL: http://www.szlcsc.com/product/details_1907.html; Package: 0402; Supplier: LC; SuppliersPartNumber: C1555
J301 = SMN-304: nano-sim-base
L100 = 0402 100Ω 25% 100MHz: 贴片电感
R101#1 = 0402 10Ω (10R0) 1%: 贴片电阻; ComponentLink1Description: 供应商链接; ComponentLink1URL: http://www.szlcsc.com/product/details_25820.html; Package: 0402; Supplier: LC; SuppliersPartNumber: C25077
R300 R301 = 0402 0Ω (0R0) 1%: 贴片电阻; ComponentLink1Description: 供应商链接; ComponentLink1URL: http://www.szlcsc.com/product/details_17853.html; Package: 0402; Supplier: LC; SuppliersPartNumber: C17168
R302#1-R302#3 = 0402 4.7KΩ (4701) 1%: 贴片电阻; ComponentLink1Description: 供应商链接; ComponentLink1URL: http://www.szlcsc.com/product/details_26643.html; Package: 0402; Supplier: LC; SuppliersPartNumber: C25900
R303 = 0402 10KΩ (1002) 1%: 贴片电阻; ComponentLink1Description: 供应商链接; ComponentLink1URL: http://www.szlcsc.com/product/details_26487.html; Package: 0402; Supplier: LC; SuppliersPartNumber: C25744
R304-R306 = 0402 22Ω (22R0) 1%: 贴片电阻; ComponentLink1Description: 供应商链接; ComponentLink1URL: http://www.szlcsc.com/product/details_25835.html; Package: 0402; Supplier: LC; SuppliersPartNumber: C25092
U103 = LDO_1.8V

## Sheet Motor_Driver_V1.0.SchDoc
size A4
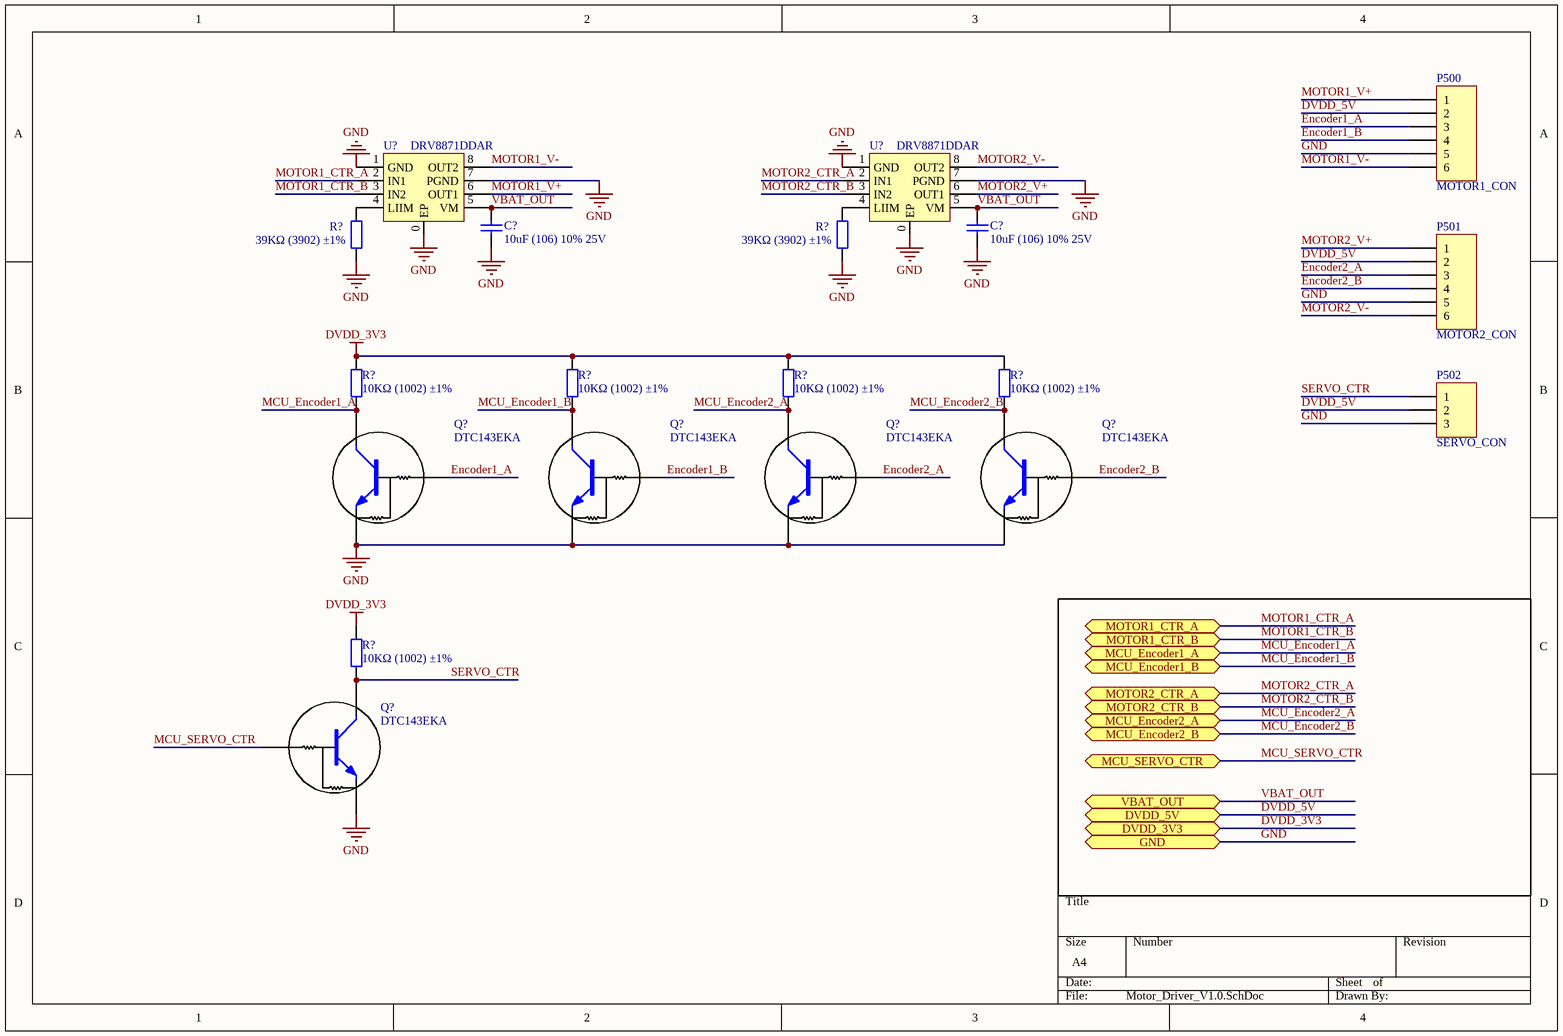
[diagram p3: Motor_Driver_V1.0.SchDoc]

### Parts
(Parts that share a designator on the sheet are numbered #1, #2 ... from top to bottom, then left to right.)
C?#5  10uF (106) 10% 25V  [0805_C]
C?#6  10uF (106) 10% 25V  [0805_C]
P500  MOTOR1_CON  [HDR1X6]
P501  MOTOR2_CON  [HDR1X6]
P502  SERVO_CON  [HDR1X3]
Q?#2  DTC143EKA  [SOT-23-3]
Q?#3  DTC143EKA  [SOT-23-3]
Q?#4  DTC143EKA  [SOT-23-3]
Q?#5  DTC143EKA  [SOT-23-3]
Q?#6  DTC143EKA  [SOT-23-3]
R?#3  39KΩ (3902) ±1%  [0402_R]
R?#4  39KΩ (3902) ±1%  [0402_R]
R?#5  10KΩ (1002) ±1%  [0603_R]
R?#6  10KΩ (1002) ±1%  [0603_R]
R?#7  10KΩ (1002) ±1%  [0603_R]
R?#8  10KΩ (1002) ±1%  [0603_R]
R?#9  10KΩ (1002) ±1%  [0603_R]
U?#4  DRV8871DDAR  [SOP-8_150mil DCDC]
U?#5  DRV8871DDAR  [SOP-8_150mil DCDC]

### Ports
DVDD_3V3, DVDD_5V, GND, MCU_Encoder1_A, MCU_Encoder1_B, MCU_Encoder2_A, MCU_Encoder2_B, MCU_SERVO_CTR, MOTOR1_CTR_A, MOTOR1_CTR_B, MOTOR2_CTR_A, MOTOR2_CTR_B, VBAT_OUT

### Nets
DVDD_3V3: R?#5.2 R?#6.2 R?#7.2 R?#8.2 R?#9.2 ; port DVDD_3V3
DVDD_5V: P500.2 P501.2 P502.2 ; port DVDD_5V
GND: C?#5.1 C?#6.1 P500.5 P501.5 P502.3 Q?#2.2(E) Q?#3.2(E) Q?#4.2(E) Q?#5.2(E) Q?#6.2(E) R?#3.1 R?#4.1 U?#4.0(EP) U?#4.1(GND) U?#4.7(PGND) U?#5.0(EP) U?#5.1(GND) U?#5.7(PGND) ; port GND
VBAT_OUT: C?#5.2 C?#6.2 U?#4.5(VM) U?#5.5(VM) ; port VBAT_OUT
Encoder1_A: P500.3 Q?#2.1(B)
Encoder1_B: P500.4 Q?#3.1(B)
Encoder2_A: P501.3 Q?#4.1(B)
Encoder2_B: P501.4 Q?#5.1(B)
MCU_Encoder1_A: Q?#2.3(C) R?#5.1 ; port MCU_Encoder1_A
MCU_Encoder1_B: Q?#3.3(C) R?#6.1 ; port MCU_Encoder1_B
MCU_Encoder2_A: Q?#4.3(C) R?#7.1 ; port MCU_Encoder2_A
MCU_Encoder2_B: Q?#5.3(C) R?#8.1 ; port MCU_Encoder2_B
MCU_SERVO_CTR: Q?#6.1(B) ; port MCU_SERVO_CTR
MOTOR1_CTR_A: U?#4.2(IN1) ; port MOTOR1_CTR_A
MOTOR1_CTR_B: U?#4.3(IN2) ; port MOTOR1_CTR_B
MOTOR1_V+: P500.1 U?#4.6(OUT1)
MOTOR1_V-: P500.6 U?#4.8(OUT2)
MOTOR2_CTR_A: U?#5.2(IN1) ; port MOTOR2_CTR_A
MOTOR2_CTR_B: U?#5.3(IN2) ; port MOTOR2_CTR_B
MOTOR2_V+: P501.1 U?#5.6(OUT1)
MOTOR2_V-: P501.6 U?#5.8(OUT2)
SERVO_CTR: P502.1 Q?#6.3(C) R?#9.1
NetR?#3_2: R?#3.2 U?#4.4(LIIM)
NetR?#4_2: R?#4.2 U?#5.4(LIIM)

### Library data of the parts
C?#5 C?#6 = 0805 10uF (106) 10% 25V: 贴片电容; ComponentLink1Description: 供应商链接; ComponentLink1URL: http://www.szlcsc.com/product/details_16532.html; Package: 0805; Supplier: LC; SuppliersPartNumber: C15850
P500 P501 = Header 6: Header, 6-Pin; LatestRevisionDate: 17-Jul-2002; LatestRevisionNote: Re-released for DXP Platform.; Publisher: Altium Limited
P502 = Header 3: Header, 3-Pin; LatestRevisionDate: 17-Jul-2002; LatestRevisionNote: Re-released for DXP Platform.; Publisher: Altium Limited
Q?#2-Q?#6 = SOT-23 DTC143EKA: 三极管
R?#3 R?#4 = 0402 39KΩ (3902) 1%: 贴片电阻; ComponentLink1Description: 供应商链接; ComponentLink1URL: http://www.szlcsc.com/product/details_26526.html; Package: 0402; Supplier: LC; SuppliersPartNumber: C25783
R?#5-R?#9 = 0603 10KΩ (1002) 1%: 贴片电阻; ComponentLink1Description: 供应商链接; ComponentLink1URL: http://www.szlcsc.com/product/details_26547.html; Package: 0603; Supplier: LC; SuppliersPartNumber: C25804
U?#4 U?#5 = DRV8871DDAR: MOTOR DRV IC

## Sheet I2C_SENSOR_V1.0.SchDoc
size A4

## Sheet PWR_SWITCH_CON_V1.0.SchDoc
size A4
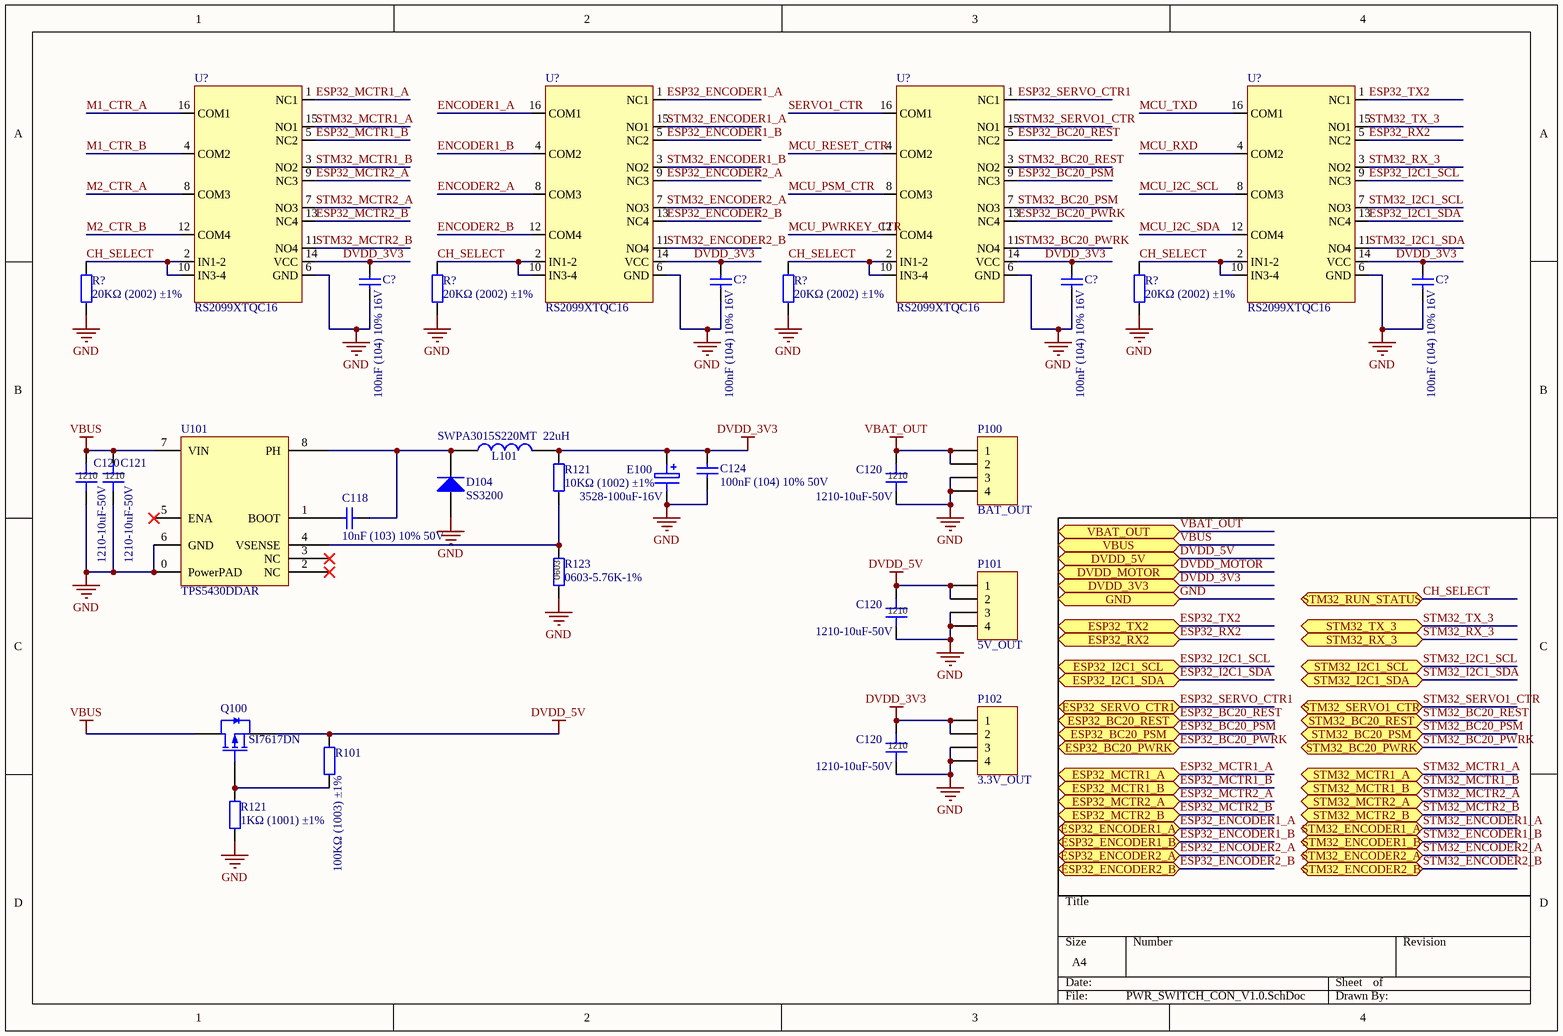
[diagram p4: PWR_SWITCH_CON_V1.0.SchDoc]

### Parts
(Parts that share a designator on the sheet are numbered #1, #2 ... from top to bottom, then left to right.)
C118  10nF (103) 10% 50V  [0603_C]
C120#1  1210-10uF-50V  [1210_C]
C120#2  1210-10uF-50V  [1210_C]
C120#3  1210-10uF-50V  [1210_C]
C120#4  1210-10uF-50V  [1210_C]
C121  1210-10uF-50V  [1210_C]
C124  100nF (104) 10% 50V  [0603_C]
C?#7  100nF (104) 10% 16V  [0402_C]
C?#8  100nF (104) 10% 16V  [0402_C]
C?#9  100nF (104) 10% 16V  [0402_C]
C?#10  100nF (104) 10% 16V  [0402_C]
D104  SS3200  [SMA(DO-214AC)_S1]
E100  3528-100uF-16V  [ES_3528]
L101  SWPA3015S220MT  22uH  [L 3.0*3.0*1.5]
P100  BAT_OUT  [HDR1X4]
P101  5V_OUT  [HDR1X4]
P102#2  3.3V_OUT  [HDR1X4]
Q100  SI7617DN  [PAK-1212-8]
R101#2  100KΩ (1003) ±1%  [0603_R]
R121#1  10KΩ (1002) ±1%  [0603_R]
R121#2  1KΩ (1001) ±1%  [0603_R]
R123  0603-5.76K-1%  [0603_R]
R?#10  20KΩ (2002) ±1%  [0402_R]
R?#11  20KΩ (2002) ±1%  [0402_R]
R?#12  20KΩ (2002) ±1%  [0402_R]
R?#13  20KΩ (2002) ±1%  [0402_R]
U101  TPS5430DDAR  [SOP-8_150mil DCDC]
U?#6  RS2099XTQC16  [QFN-16_3x3x05P]
U?#7  RS2099XTQC16  [QFN-16_3x3x05P]
U?#8  RS2099XTQC16  [QFN-16_3x3x05P]
U?#9  RS2099XTQC16  [QFN-16_3x3x05P]

### Ports
DVDD_3V3, DVDD_5V, DVDD_MOTOR, ESP32_BC20_PSM, ESP32_BC20_PWRK, ESP32_BC20_REST, ESP32_ENCODER1_A, ESP32_ENCODER1_B, ESP32_ENCODER2_A, ESP32_ENCODER2_B, ESP32_I2C1_SCL, ESP32_I2C1_SDA, ESP32_MCTR1_A, ESP32_MCTR1_B, ESP32_MCTR2_A, ESP32_MCTR2_B, ESP32_RX2, ESP32_SERVO_CTR1, ESP32_TX2, GND, STM32_BC20_PSM, STM32_BC20_PWRK, STM32_BC20_REST, STM32_ENCODER1_A, STM32_ENCODER1_B, STM32_ENCODER2_A, STM32_ENCODER2_B, STM32_I2C1_SCL, STM32_I2C1_SDA, STM32_MCTR1_A, STM32_MCTR1_B, STM32_MCTR2_A, STM32_MCTR2_B, STM32_RUN_STATUS, STM32_RX_3, STM32_SERVO1_CTR, STM32_TX_3, VBAT_OUT, VBUS

### Nets
DVDD_3V3: C120#4.1 C124.2 C?#7.2 C?#8.2 C?#9.2 C?#10.2 E100.1 L101.2 P102#2.1 P102#2.2 R121#1.2 U?#6.14(VCC) U?#7.14(VCC) U?#8.14(VCC) U?#9.14(VCC) ; port DVDD_3V3
DVDD_5V: C120#3.1 P101.1 P101.2 Q100.2(S) R101#2.2 ; port DVDD_5V
GND: C120#1.2 C120#2.2 C120#3.2 C120#4.2 C121.2 C124.1 C?#7.1 C?#8.1 C?#9.1 C?#10.1 D104.1(A) E100.2(E) P100.3 P100.4 P101.3 P101.4 P102#2.3 P102#2.4 R121#2.1 R123.1 R?#10.1 R?#11.1 R?#12.1 R?#13.1 U101.0(PowerPAD) U101.6(GND) U?#6.6(GND) U?#7.6(GND) U?#8.6(GND) U?#9.6(GND) ; port GND
VBAT_OUT: C120#2.1 P100.1 P100.2 ; port VBAT_OUT
VBUS: C120#1.1 C121.1 Q100.3(D) U101.7(VIN) ; port VBUS
CH_SELECT: R?#10.2 R?#11.2 R?#12.2 R?#13.2 U?#6.2(IN1-2) U?#6.10(IN3-4) U?#7.2(IN1-2) U?#7.10(IN3-4) U?#8.2(IN1-2) U?#8.10(IN3-4) U?#9.2(IN1-2) U?#9.10(IN3-4) ; port STM32_RUN_STATUS
DVDD_MOTOR: port DVDD_MOTOR
ENCODER1_A: U?#7.16(COM1)
ENCODER1_B: U?#7.4(COM2)
ENCODER2_A: U?#7.8(COM3)
ENCODER2_B: U?#7.12(COM4)
ESP32_BC20_PSM: U?#8.9(NC3) ; port ESP32_BC20_PSM
ESP32_BC20_PWRK: U?#8.13(NC4) ; port ESP32_BC20_PWRK
ESP32_BC20_REST: U?#8.5(NC2) ; port ESP32_BC20_REST
ESP32_ENCODER1_A: U?#7.1(NC1) ; port ESP32_ENCODER1_A
ESP32_ENCODER1_B: U?#7.5(NC2) ; port ESP32_ENCODER1_B
ESP32_ENCODER2_A: U?#7.9(NC3) ; port ESP32_ENCODER2_A
ESP32_ENCODER2_B: U?#7.13(NC4) ; port ESP32_ENCODER2_B
ESP32_I2C1_SCL: U?#9.9(NC3) ; port ESP32_I2C1_SCL
ESP32_I2C1_SDA: U?#9.13(NC4) ; port ESP32_I2C1_SDA
ESP32_MCTR1_A: U?#6.1(NC1) ; port ESP32_MCTR1_A
ESP32_MCTR1_B: U?#6.5(NC2) ; port ESP32_MCTR1_B
ESP32_MCTR2_A: U?#6.9(NC3) ; port ESP32_MCTR2_A
ESP32_MCTR2_B: U?#6.13(NC4) ; port ESP32_MCTR2_B
ESP32_RX2: U?#9.5(NC2) ; port ESP32_RX2
ESP32_SERVO_CTR1: U?#8.1(NC1) ; port ESP32_SERVO_CTR1
ESP32_TX2: U?#9.1(NC1) ; port ESP32_TX2
M1_CTR_A: U?#6.16(COM1)
M1_CTR_B: U?#6.4(COM2)
M2_CTR_A: U?#6.8(COM3)
M2_CTR_B: U?#6.12(COM4)
MCU_I2C_SCL: U?#9.8(COM3)
MCU_I2C_SDA: U?#9.12(COM4)
MCU_PSM_CTR: U?#8.8(COM3)
MCU_PWRKEY_CTR: U?#8.12(COM4)
MCU_RESET_CTR: U?#8.4(COM2)
MCU_RXD: U?#9.4(COM2)
MCU_TXD: U?#9.16(COM1)
SERVO1_CTR: U?#8.16(COM1)
STM32_BC20_PSM: U?#8.7(NO3) ; port STM32_BC20_PSM
STM32_BC20_PWRK: U?#8.11(NO4) ; port STM32_BC20_PWRK
STM32_BC20_REST: U?#8.3(NO2) ; port STM32_BC20_REST
STM32_ENCODER1_A: U?#7.15(NO1) ; port STM32_ENCODER1_A
STM32_ENCODER1_B: U?#7.3(NO2) ; port STM32_ENCODER1_B
STM32_ENCODER2_A: U?#7.7(NO3) ; port STM32_ENCODER2_A
STM32_ENCODER2_B: U?#7.11(NO4) ; port STM32_ENCODER2_B
STM32_I2C1_SCL: U?#9.7(NO3) ; port STM32_I2C1_SCL
STM32_I2C1_SDA: U?#9.11(NO4) ; port STM32_I2C1_SDA
STM32_MCTR1_A: U?#6.15(NO1) ; port STM32_MCTR1_A
STM32_MCTR1_B: U?#6.3(NO2) ; port STM32_MCTR1_B
STM32_MCTR2_A: U?#6.7(NO3) ; port STM32_MCTR2_A
STM32_MCTR2_B: U?#6.11(NO4) ; port STM32_MCTR2_B
STM32_RX_3: U?#9.3(NO2) ; port STM32_RX_3  [project net ESP32_TX1]
STM32_SERVO1_CTR: U?#8.15(NO1) ; port STM32_SERVO1_CTR
STM32_TX_3: U?#9.15(NO1) ; port STM32_TX_3  [project net ESP32_RX1]
NetC118_1: C118.1 U101.1(BOOT)
NetC118_2: C118.2 D104.2(K) L101.1 U101.8(PH)
NetQ100_1: Q100.1(G) R101#2.1 R121#2.2
NetR121#1_1: R121#1.1 R123.2 U101.4(VSENSE)

Not connected (* = marked no-connect by the designer): U101 2(NC)* 3(NC)* 5(ENA)*

### Notes on the sheet
- (in symbol 0603 10KΩ (103) 1%) 0603
- (in symbol 1210 10uF (106) 10% 50V) 1210

### Library data of the parts
C118 = 0603 10nF (103) 10% 50V: 贴片电容; ComponentLink1Description: 供应商链接; ComponentLink1URL: http://www.szlcsc.com/product/details_58143.html; Package: 0603; Supplier: LC; SuppliersPartNumber: C57112
C120#1-C120#4 C121 = 1210 10uF (106) 10% 50V: 贴片电容
C124 = 0603 100nF (104) 10% 50V: 贴片电容; ComponentLink1Description: 供应商链接; ComponentLink1URL: http://www.szlcsc.com/product/details_15331.html; Package: 0603; Supplier: LC; SuppliersPartNumber: C14663
C?#7-C?#10 = 0402 100nF (104) 10% 16V: 贴片电容; ComponentLink1Description: 供应商链接; ComponentLink1URL: http://www.szlcsc.com/product/details_1877.html; Package: 0402; Supplier: LC; SuppliersPartNumber: C1525
D104 = SMA(DO-214AC) M7: 二极管
E100 = ES-3528: 贴片钽电容
L101 = 10uH 20%: 贴片电感
P100 P101 P102#2 = Header 4: Header, 4-Pin; LatestRevisionDate: 17-Jul-2002; LatestRevisionNote: Re-released for DXP Platform.; Publisher: Altium Limited
Q100 = SI7617DN: P-MOS
R101#2 = 0603 100KΩ (1003) 1%: 贴片电阻; ComponentLink1Description: 供应商链接; ComponentLink1URL: http://www.szlcsc.com/product/details_26546.html; Package: 0603; Supplier: LC; SuppliersPartNumber: C25803
R121#1 = 0603 10KΩ (1002) 1%: 贴片电阻; ComponentLink1Description: 供应商链接; ComponentLink1URL: http://www.szlcsc.com/product/details_26547.html; Package: 0603; Supplier: LC; SuppliersPartNumber: C25804
R121#2 = 0603 1KΩ (1001) 1%: 贴片电阻; ComponentLink1Description: 供应商链接; ComponentLink1URL: http://www.szlcsc.com/product/details_21904.html; Package: 0603; Supplier: LC; SuppliersPartNumber: C21190
R123 = 0603 10KΩ (103) 1%: 贴片电阻
R?#10-R?#13 = 0402 20KΩ (2002) 1%: 贴片电阻; ComponentLink1Description: 供应商链接; ComponentLink1URL: http://www.szlcsc.com/product/details_26508.html; Package: 0402; Supplier: LC; SuppliersPartNumber: C25765
U101 = TPS5430DDAR: DC-DC芯片; Notepad: 0 pin:        GND pin must be connected to the exposed pad for proper operation.; Package: SOP-8_EP_150mil
U?#6-U?#9 = RS2099XTQC16: IO SWITCH

## Nets that join several sheets
DVDD_3V3: STM32_Module_V1.0 (21 pins), ESP32_Module_V1.0 (6 pins), BC20_Module_V1.0 (16 pins), Motor_Driver_V1.0 (5 pins), PWR_SWITCH_CON_V1.0 (15 pins)
DVDD_5V: Motor_Driver_V1.0 (P500.2 P501.2 P502.2), PWR_SWITCH_CON_V1.0 (5 pins)
GND: STM32_Module_V1.0 (27 pins), ESP32_Module_V1.0 (21 pins), BC20_Module_V1.0 (33 pins), Motor_Driver_V1.0 (18 pins), PWR_SWITCH_CON_V1.0 (30 pins)
VBAT_OUT: Motor_Driver_V1.0 (C?#5.2 C?#6.2 U?#4.5 U?#5.5), PWR_SWITCH_CON_V1.0 (C120#2.1 P100.1 P100.2)
VBUS: STM32_Module_V1.0 (P102#1.1), ESP32_Module_V1.0 (P1.1 R4.1), PWR_SWITCH_CON_V1.0 (C120#1.1 C121.1 Q100.3 U101.7)
CH_SELECT: STM32_Module_V1.0 (R?#1.2 R?#2.2 U?#1.2), ESP32_Module_V1.0 (U200.10), PWR_SWITCH_CON_V1.0 (12 pins)
EN: STM32_Module_V1.0 (U?#1.29), ESP32_Module_V1.0 (5 pins)
ESP32_BC20_PSM: ESP32_Module_V1.0 (U200.22), PWR_SWITCH_CON_V1.0 (U?#8.9)
ESP32_BC20_PWRK: ESP32_Module_V1.0 (U200.21), PWR_SWITCH_CON_V1.0 (U?#8.13)
ESP32_BC20_REST: ESP32_Module_V1.0 (U200.20), PWR_SWITCH_CON_V1.0 (U?#8.5)
ESP32_ENCODER1_A: ESP32_Module_V1.0 (U200.5), PWR_SWITCH_CON_V1.0 (U?#7.1)
ESP32_ENCODER1_B: ESP32_Module_V1.0 (U200.8), PWR_SWITCH_CON_V1.0 (U?#7.5)
ESP32_ENCODER2_A: ESP32_Module_V1.0 (U200.6), PWR_SWITCH_CON_V1.0 (U?#7.9)
ESP32_ENCODER2_B: ESP32_Module_V1.0 (U200.7), PWR_SWITCH_CON_V1.0 (U?#7.13)
ESP32_I2C1_SCL: ESP32_Module_V1.0 (U200.36), PWR_SWITCH_CON_V1.0 (U?#9.9)
ESP32_I2C1_SDA: ESP32_Module_V1.0 (U200.35), PWR_SWITCH_CON_V1.0 (U?#9.13)
ESP32_MCTR1_A: ESP32_Module_V1.0 (U200.14), PWR_SWITCH_CON_V1.0 (U?#6.1)
ESP32_MCTR1_B: ESP32_Module_V1.0 (U200.15), PWR_SWITCH_CON_V1.0 (U?#6.5)
ESP32_MCTR2_A: ESP32_Module_V1.0 (U200.16), PWR_SWITCH_CON_V1.0 (U?#6.9)
ESP32_MCTR2_B: ESP32_Module_V1.0 (U200.17), PWR_SWITCH_CON_V1.0 (U?#6.13)
ESP32_RX1: STM32_Module_V1.0 (U?#1.21), ESP32_Module_V1.0 (U200.38), PWR_SWITCH_CON_V1.0 (U?#9.15)
ESP32_RX2: ESP32_Module_V1.0 (U200.34), PWR_SWITCH_CON_V1.0 (U?#9.5)
ESP32_SERVO_CTR1: ESP32_Module_V1.0 (U200.18), PWR_SWITCH_CON_V1.0 (U?#8.1)
ESP32_TX1: STM32_Module_V1.0 (U?#1.22), ESP32_Module_V1.0 (U200.39), PWR_SWITCH_CON_V1.0 (U?#9.3)
ESP32_TX2: ESP32_Module_V1.0 (U200.24), PWR_SWITCH_CON_V1.0 (U?#9.1)
IO21: STM32_Module_V1.0 (C206.1 R203#4.1 U?#1.7), ESP32_Module_V1.0 (U200.42)
STM32_BC20_PSM: STM32_Module_V1.0 (U?#1.39), PWR_SWITCH_CON_V1.0 (U?#8.7)
STM32_BC20_PWRK: STM32_Module_V1.0 (U?#1.19), PWR_SWITCH_CON_V1.0 (U?#8.11)
STM32_BC20_REST: STM32_Module_V1.0 (U?#1.18), PWR_SWITCH_CON_V1.0 (U?#8.3)
STM32_ENCODER1_A: STM32_Module_V1.0 (U?#1.25), PWR_SWITCH_CON_V1.0 (U?#7.15)
STM32_ENCODER1_B: STM32_Module_V1.0 (U?#1.26), PWR_SWITCH_CON_V1.0 (U?#7.3)
STM32_ENCODER2_A: STM32_Module_V1.0 (U?#1.27), PWR_SWITCH_CON_V1.0 (U?#7.7)
STM32_ENCODER2_B: STM32_Module_V1.0 (U?#1.28), PWR_SWITCH_CON_V1.0 (U?#7.11)
STM32_I2C1_SCL: STM32_Module_V1.0 (R203#1.1 U?#1.42), PWR_SWITCH_CON_V1.0 (U?#9.7)
STM32_I2C1_SDA: STM32_Module_V1.0 (R203#2.1 U?#1.43), PWR_SWITCH_CON_V1.0 (U?#9.11)
STM32_MCTR1_A: STM32_Module_V1.0 (U?#1.40), PWR_SWITCH_CON_V1.0 (U?#6.15)
STM32_MCTR1_B: STM32_Module_V1.0 (U?#1.41), PWR_SWITCH_CON_V1.0 (U?#6.3)
STM32_MCTR2_A: STM32_Module_V1.0 (U?#1.45), PWR_SWITCH_CON_V1.0 (U?#6.7)
STM32_MCTR2_B: STM32_Module_V1.0 (U?#1.46), PWR_SWITCH_CON_V1.0 (U?#6.11)
STM32_SERVO1_CTR: STM32_Module_V1.0 (U?#1.38), PWR_SWITCH_CON_V1.0 (U?#8.15)